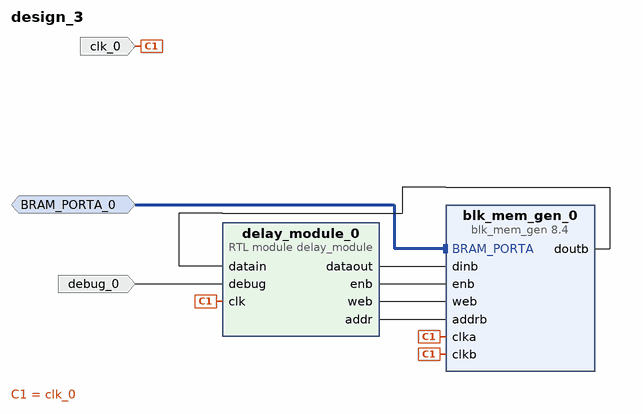
[diagram p0: block diagram of the top level]
# Vivado block design design_3, xc7z010clg400-1, Vivado 2019.2
create_bd_design design_3

create_bd_intf_port -mode Slave -vlnv xilinx.com:interface:bram_rtl:1.0 BRAM_PORTA_0
set_property -dict {CONFIG.MASTER_TYPE BRAM_CTRL CONFIG.READ_WRITE_MODE READ_WRITE} [get_bd_intf_ports BRAM_PORTA_0]
create_bd_port -dir I -type clk clk_0
create_bd_port -dir I debug_0

create_bd_cell -type ip -vlnv xilinx.com:ip:blk_mem_gen:8.4 blk_mem_gen_0
set_property -dict [list \
  CONFIG.Enable_B Use_ENB_Pin \
  CONFIG.Memory_Type True_Dual_Port_RAM \
  CONFIG.Port_B_Clock 100 \
  CONFIG.Port_B_Enable_Rate 100 \
  CONFIG.Port_B_Write_Rate 50 \
  CONFIG.Use_RSTB_Pin true \
] [get_bd_cells blk_mem_gen_0]
create_bd_cell -type module -reference delay_module delay_module_0

# ---- connections ----

connect_bd_intf_net -intf_net BRAM_PORTA_0_1 [get_bd_intf_ports BRAM_PORTA_0] [get_bd_intf_pins blk_mem_gen_0/BRAM_PORTA]
connect_bd_net -net clk_0_1 [get_bd_ports clk_0] [get_bd_pins blk_mem_gen_0/clka] [get_bd_pins blk_mem_gen_0/clkb] [get_bd_pins delay_module_0/clk]
connect_bd_net [get_bd_pins delay_module_0/dataout] [get_bd_pins blk_mem_gen_0/dinb]
connect_bd_net [get_bd_pins blk_mem_gen_0/doutb] [get_bd_pins delay_module_0/datain]
connect_bd_net [get_bd_pins delay_module_0/enb] [get_bd_pins blk_mem_gen_0/enb]
connect_bd_net [get_bd_pins delay_module_0/web] [get_bd_pins blk_mem_gen_0/web]
connect_bd_net [get_bd_pins delay_module_0/addr] [get_bd_pins blk_mem_gen_0/addrb]
connect_bd_net -net debug_0_1 [get_bd_ports debug_0] [get_bd_pins delay_module_0/debug]

validate_bd_design
save_bd_design
